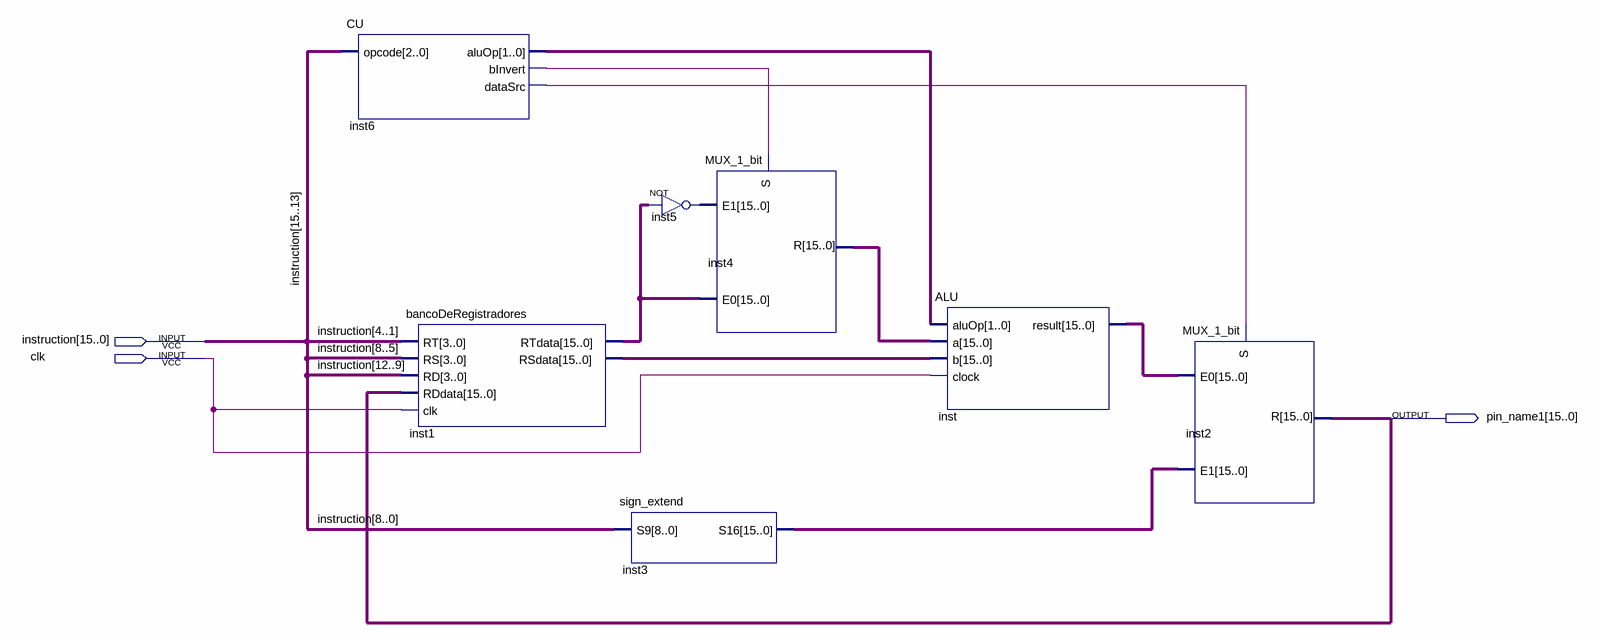
[diagram p0: schematic sheet]
// Quartus schematic IncompleteDatapath.bdf as structural Verilog: 7 symbols, 3 pins
module IncompleteDatapath (
  input  [15:0] instruction,
  input  clk,
  output [15:0] pin_name1
);

  wire inst6_binvert, inst6_datasrc;
  wire [1:0] inst6_aluop;
  wire [15:0] inst1_rsdata, inst1_rtdata, inst3_s16, inst4_r, inst5_out, inst_result;

  CU inst6 (.opcode(instruction[15:13]), .aluOp(inst6_aluop), .bInvert(inst6_binvert), .dataSrc(inst6_datasrc));
  bancoDeRegistradores inst1 (
    .RT(instruction[4:1]), .RS(instruction[8:5]), .RD(instruction[12:9]), .RDdata(pin_name1), .clk(clk),
    .RTdata(inst1_rtdata), .RSdata(inst1_rsdata));
  sign_extend inst3 (.S9(instruction[8:0]), .S16(inst3_s16));
  assign inst5_out = ~inst1_rtdata;  // NOT inst5, 16 bits wide
  MUX_1_bit inst4 (.S(inst6_binvert), .E0(inst1_rtdata), .E1(inst5_out), .R(inst4_r));
  ALU inst (.aluOp(inst6_aluop), .a(inst4_r), .b(inst1_rsdata), .clock(clk), .result(inst_result));
  MUX_1_bit inst2 (.S(inst6_datasrc), .E0(inst_result), .E1(inst3_s16), .R(pin_name1));
endmodule
